# Altium project SWG.PrjPcb
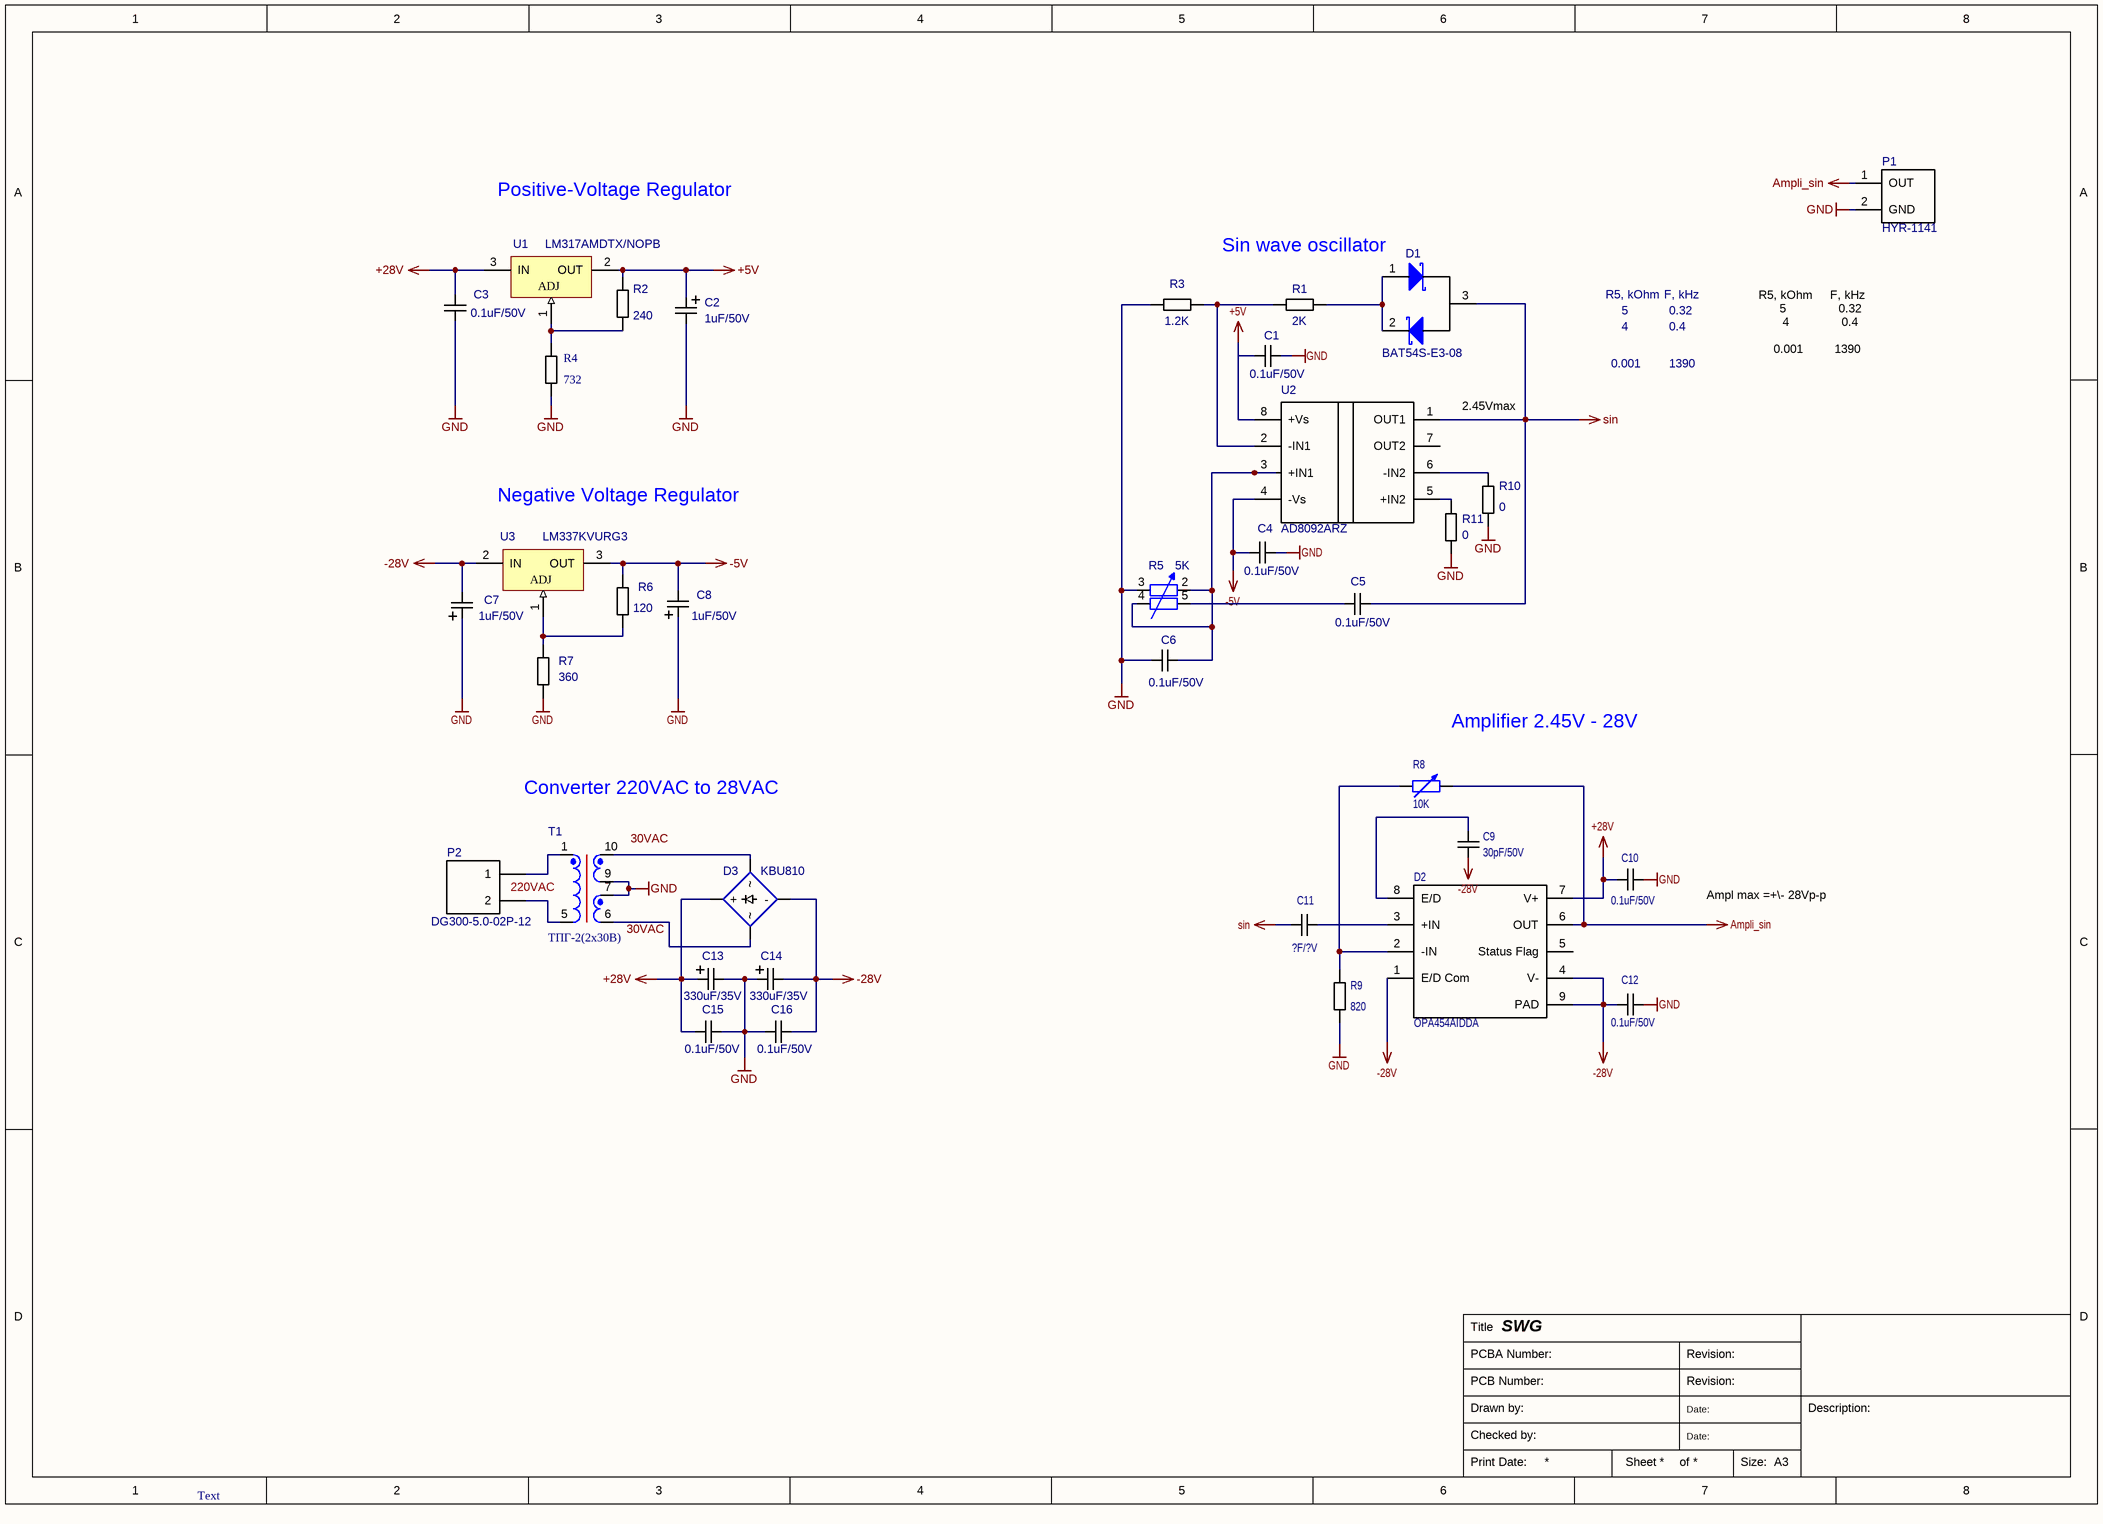
[diagram p0: SWG.SchDoc]
PKBT_Title: SWG
1 sheet, 36 parts. Net scope: global (net labels, ports and power ports of the same name join across sheets).
Board file: SWG.PcbDoc

## Sheet SWG.SchDoc
size A3

### Parts
C1  0.1uF/50V  [C0603]
C2  1uF/50V  [UCHEMI-CON_CAP0404_RAD]
C3  0.1uF/50V  [C0603]
C4  0.1uF/50V  [C0603]
C5  0.1uF/50V  [C0603]
C6  0.1uF/50V  [C0603]
C7  1uF/50V  [UCHEMI-CON_CAP0404_RAD]
C8  1uF/50V  [UCHEMI-CON_CAP0404_RAD]
C9  30pF/50V  [C0603]
C10  0.1uF/50V  [C0603]
C11  ?F/?V  [C0603]
C12  0.1uF/50V  [C0603]
C13  330uF/35V  [UCHEMI-CON_CAP1010_RAD]
C14  330uF/35V  [UCHEMI-CON_CAP1010_RAD]
C15  0.1uF/50V  [C0603]
C16  0.1uF/50V  [C0603]
D1  BAT54S-E3-08  [SOT23-3L]
D2  OPA454AIDDA  [TI_8SOICPAD]
D3  KBU810  [KBU8]
P1  HYR-1141  [SMA]
P2  DG300-5.0-02P-12  [DG300-5.0-02P-12]
R1  2K  [R0603]
R2  240  [R0603]
R3  1.2K  [R0603]
R4  732  [R0603]
R5  5K  [RES_Adj_duble_5K]
R6  120  [R0603]
R7  360  [R0603]
R8  10K  [RES_Adj_10K]
R9  820  [R0603]
R10  0  [R0603]
R11  0  [R0603]
T1  ТПГ-2(2х30В)  [ТПГ-2 (2x30)]
U1  LM317AMDTX/NOPB  [SC_TO-252A]
U2  AD8092ARZ  [AD_SOIC-8_R-8_Rev4]
U3  LM337KVURG3  [SC_TO-252A]

### Nets
+5V: C1.1 C2.1(+) R2.2 U1.2(OUT) U2.8(+Vs)
+28V: C3.2 C10.1 C13.1(+) C15.1 D2.7(V+) D3.1(+) U1.3(IN)
-5V: C4.1 C8.2(-) R6.2 U2.4(-Vs) U3.3(OUT)
-28V: C7.2(-) C9.2 C12.1 C14.2(-) C16.2 D2.1(E/D_Com) D2.4(V-) D2.9(PAD) D3.4(-) U3.2(IN)
Ampli_sin: D2.6(OUT) P1.1(OUT) R8.2
GND: C1.2 C2.2(-) C3.1 C4.2 C6.1 C7.1(+) C8.1(+) C10.2 C12.2 C13.2(-) C14.1(+) C15.2 C16.1 P1.2(GND) R3.1 R4.1 R5.3 R7.1 R9.1 R10.2 R11.2 T1.7 T1.9
sin: C5.2 C11.1 D1.3(K1A2) U2.1(OUT1)
NetC5_1: C5.1 R5.5
NetC6_2: C6.2 R5.2 R5.4 U2.3(+IN1)
NetC9_1: C9.1 D2.8(E/D)
NetC11_2: C11.2 D2.3(+IN)
NetD1_1: D1.1(A1) D1.2(K2) R1.2
NetD2_2: D2.2(-IN) R8.1 R9.2
NetD3_2: D3.2 T1.10
NetD3_3: D3.3 T1.6
NetP2_1: P2.1 T1.1
NetP2_2: P2.2 T1.5
NetR1_1: R1.1 R3.2 U2.2(-IN1)
NetR2_1: R2.1 R4.2 U1.1(ADJ)
NetR6_1: R6.1 R7.2 U3.1(ADJ)
NetR10_1: R10.1 U2.6(-IN2)
NetR11_1: R11.1 U2.5(+IN2)

Not connected (* = marked no-connect by the designer): D2 5(Status_Flag); U2 7(OUT2)

### Notes on the sheet
- Positive-Voltage Regulator
- (near D1) Sin wave oscillator
- R5, kOhm
- 5
- F, kHz
- 0.32
- 0.001
- 4
- 1390
- 0.4
- R5, kOhm     F, kHz
  5               0.32
  4               0.4
  0.001         1390
- 2.45Vmax
- Negative Voltage Regulator
- Amplifier 2.45V - 28V
- Converter 220VAC to 28VAC
- (near P2) 220VAC
- Ampl max =+\- 28Vp-p
- Text
- Labels drawn without touching a wire or pin: 30VAC
- Title
- PCBA Number:
- PCB Number:
- Revision:
- Drawn by:
- Checked by:
- Date:
- Description:
- Print Date:
- Sheet
- of
- Size:
- A3

### Library data of the parts
C1 C3 C4 C6 = CAP_0603_0.1uF/50V: Ceramic chip capacitor. 0.1 UF X7R 50V 10% 0603; Manufacturer: Murata Manufacturing; PartNumber: GRM188R71H104KA93D; Group: CAP; Value: 0.1uF/50V; Package: 0603
C2 C7 C8 = CAP_electrolit_1uf: Electrolytic smd capacitor 1 UF 50V; Manufacturer: JB; PartNumber: JCK1H010M040054; Group: CAP; Value: 1uF/50V; Package: *
C5 = CAP_0603_0.1F/50V: Manufacturer: Murata Manufacturing; PartNumber: GRM188R71H104KA93D; Group: CAP; Value: 0.1uF/50V; Package: 0603
C9 = CAP_0603_30pF/50V: Manufacturer: Murata Manufacturing; PartNumber: GRM2165C1H300JZ01D; Group: CAP; Value: 30pF/50V; Package: 0603
C10 C12 C15 C16 = CAP_0603_0.1F/50V: Ceramic chip capacitor. 0.1 UF X7R 50V 10% 0603; Manufacturer: Murata Manufacturing; PartNumber: GRM188R71H104KA93D; Group: CAP; Value: 0.1uF/50V; Package: 0603
C11 = CAP_0603_?F/?V: Manufacturer: Murata Manufacturing; Group: CAP; PartNumber: ?; Value: ?F/?V; Package: 0603
C13 C14 = CAP_electrolit_330uf: Manufacturer: JB; PartNumber: JCK1V331M100105; Group: CAP; Value: 330uF/35V; Package: *
D1 = Diode BAT54S: Dual Schottky Rectifier, SOT-23, 30V 200mA; Manufacturer: Vishay; Group: DIOD; ComponentLink1Description: Manufacturer Link; ComponentLink1URL: http://www.irf.com/; ComponentLink2Description: Datasheet; ComponentLink2URL: http://www.irf.com/product-info/datasheets/data/10tq.pdf; PartNumber: BAT54S-E3-08; Package: SOT23
D2 = CH_OPA454AIDDA: IC OPAMP GP 1 CIRCUIT 8SOPWRPAD; Manufacturer: Texas Instruments; Group: CH; PartNumber: OPA454AIDDA
D3 = KBU810: KBU8 series bridge single-phase rectifier, 8А, 1000V; Manufacturer: China; Group: DIOD; PartNumber: KBU810
P1 = SMA: Manufacturer: New Centress (HOYUTEC); Group: CON; PartNumber: HYR-1141
P2 = DG300-5.0-02P-12: Manufacturer: Degson Electronics; Group: CON; Digi-Key Part Number: *; PartNumber: DG300-5.0-02P-12
R1 = RES_0603_2K: Manufacturer: Yageo; PartNumber: RC0603FR-0744K2L; Group: RES; Value: 2K; Package: 0603
R2 = RES_0402_240: RES SMD 240 OHM 1% 1/10W 0603; Manufacturer: Panasonic Electronic Components; PartNumber: ERJ-3EKF2400V; Group: RES; Value: 240; Package: 0603; Tolerance: ±1%
R3 = RES_0603_1.2K: Manufacturer: Yageo; PartNumber: RC0603FR-071K2L; Group: RES; Value: 1.2K; Package: 0603
R4 = RES_0402_732: RES SMD 732 OHM 1% 1/10W 0603; Manufacturer: Panasonic Electronic Components; PartNumber: ERJ-3EKF7320V; Group: RES; Value: 732; Package: 0603; Tolerance: ±1%
R5 = RES_Adj_duble_5K: Dual variable resistor WH148-2, resistance nominal 5kom. Metal handle with a recess for the cap.; Manufacturer: China; Group: RES; Value: 5K; PartNumber: WH148-2
R6 = RES_0402: Manufacturer: Panasonic Electronic Components Panasonic Electronic Components; PartNumber: ERJ-2RKF1200X; Group: RES; Tolerance: ±1%; Value: 120; Package: 0603; RoHS: ROHS3 Compliant
R7 = RES_0402: RES SMD 360 OHM 1% 1/10W 0603; Manufacturer: Panasonic Electronic Components; PartNumber: ERJ-3EKF3600V; Group: RES; Value: 360; Package: 0603; Tolerance: ±1%
R8 = Res_Adj_10K: Variable Resistor; PartNumber: 16K1-10C10K,L15KC; Manufacturer: China; Group: RES; Value: 10K
R9 = RES_0603_820: Manufacturer: Yageo; PartNumber: RC0603FR-07820RL; Group: RES; Value: 820; Package: 0603
R10 R11 = RES_0603_0: Manufacturer: Yageo; PartNumber: RC0603JR-070RL; Group: RES; Value: 0; Package: 0603
T1 = ТПГ-2 (2x30): Sealed transformer; Manufacturer: Комплекс; Group: TRANSF; PartNumber: ТПГ-2(2х30В); Parameter 2: *
U1 = LM317AMDTX/NOPB: 3-Terminal Adjustable Regulator; Manufacturer: Texas Instruments; Group: CH; PartNumber: LM317AMDTX/NOPB; ComponentLink1Description: LM317 Datasheet; ComponentLink1URL: http://www.national.com/ds/LM/LM317.pdf; ComponentLink2Description: LM317 Web Page; ComponentLink2URL: http://www.national.com/pf/LM/LM317.html; ComponentLink3Description: T03B Package Page; ComponentLink3URL: http://www.national.com/packaging/folders/t03b.html; Package: TO-252A
U2 = AD8092ARZ_1: Manufacturer: Analog Devices; Group: CH; PartNumber: AD8092ARZ
U3 = LM337KVURG3: 3-Terminal Adjustable Negative Regulator; Manufacturer: Texas Instruments; Group: CH; PartNumber: LM337KVURG3; ComponentLink1Description: LM337 Datasheet; ComponentLink1URL: http://www.national.com/ds/LM/LM337.pdf; ComponentLink2Description: LM337 Web Page; ComponentLink2URL: http://www.national.com/pf/LM/LM337.html; ComponentLink3Description: T03B Package Page; ComponentLink3URL: http://www.national.com/packaging/folders/t03b.html; Package: TO-252A